# Altium project Python_Imaging.PrjPcb
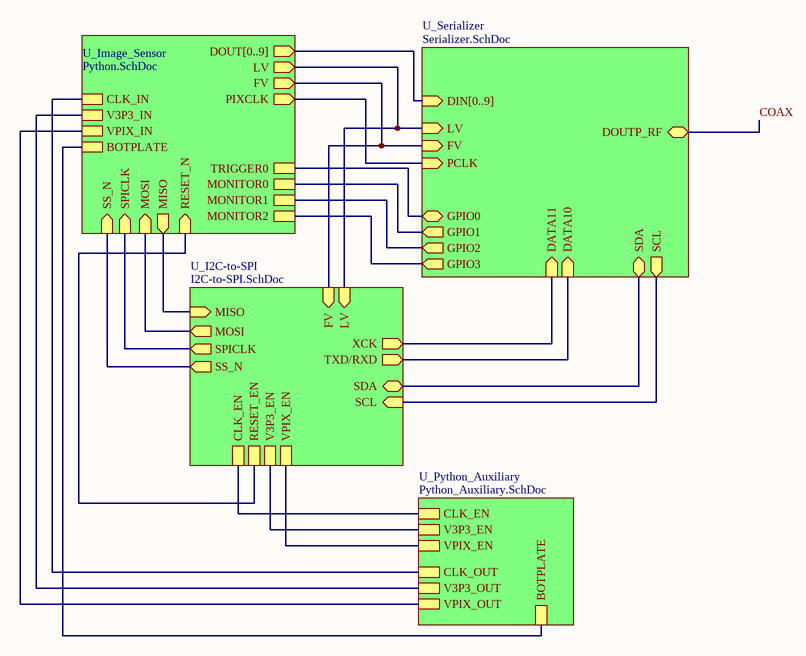
[diagram p0: Overall.SchDoc]
5 sheets, 59 parts. Net scope: hierarchical (ports join the sheet entries above them; power ports are global).
Board file: PCB2.PcbDoc
Sheets:
  Overall.SchDoc
    U_Image_Sensor = Python.SchDoc
    U_Serializer = Serializer.SchDoc
    U_I2C-to-SPI = I2C-to-SPI.SchDoc
    U_Python_Auxiliary = Python_Auxiliary.SchDoc

## Sheet Overall.SchDoc
size A

### Sub-sheets
U_I2C-to-SPI = I2C-to-SPI.SchDoc: SCL (in), SDA (bidir), MOSI (out), MISO (in), SPICLK (out), SS_N (out), TXD/RXD (out), XCK (out), FV (in), LV (in), CLK_EN, RESET_EN, V3P3_EN, VPIX_EN
U_Image_Sensor = Python.SchDoc: FV (out), LV (out), PIXCLK (out), DOUT[0..9] (out), SS_N (in), MISO (out), MOSI (in), SPICLK (in), RESET_N (in), CLK_IN, V3P3_IN, VPIX_IN, BOTPLATE, TRIGGER0, MONITOR0, MONITOR1, MONITOR2
U_Python_Auxiliary = Python_Auxiliary.SchDoc: CLK_EN, V3P3_EN, VPIX_EN, CLK_OUT, V3P3_OUT, VPIX_OUT, BOTPLATE
U_Serializer = Serializer.SchDoc: GPIO3 (out), GPIO2 (out), GPIO1 (out), GPIO0 (bidir), LV (in), FV (in), PCLK (in), SCL (out), SDA (bidir), DIN[0..9] (in), DOUTP_RF (bidir), DATA10 (in), DATA11 (in)

### Nets
BOTPLATE: sheet U_Image_Sensor/BOTPLATE, sheet U_Python_Auxiliary/BOTPLATE
CLK_EN: sheet U_I2C-to-SPI/CLK_EN, sheet U_Python_Auxiliary/CLK_EN
CLK_IN: sheet U_Image_Sensor/CLK_IN, sheet U_Python_Auxiliary/CLK_OUT
FV: sheet U_Image_Sensor/FV, sheet U_Serializer/FV, sheet U_I2C-to-SPI/FV
GPIO0: sheet U_Image_Sensor/TRIGGER0, sheet U_Serializer/GPIO0
GPIO1: sheet U_Image_Sensor/MONITOR0, sheet U_Serializer/GPIO1
GPIO2: sheet U_Image_Sensor/MONITOR1, sheet U_Serializer/GPIO2
GPIO3: sheet U_Image_Sensor/MONITOR2, sheet U_Serializer/GPIO3
LV: sheet U_Image_Sensor/LV, sheet U_Serializer/LV, sheet U_I2C-to-SPI/LV
MISO: sheet U_Image_Sensor/MISO, sheet U_I2C-to-SPI/MISO
MOSI: sheet U_Image_Sensor/MOSI, sheet U_I2C-to-SPI/MOSI
PCLK: sheet U_Image_Sensor/PIXCLK, sheet U_Serializer/PCLK
RESET_EN: sheet U_Image_Sensor/RESET_N, sheet U_I2C-to-SPI/RESET_EN
SCL: sheet U_Serializer/SCL, sheet U_I2C-to-SPI/SCL
SDA: sheet U_Serializer/SDA, sheet U_I2C-to-SPI/SDA
SPICLK: sheet U_Image_Sensor/SPICLK, sheet U_I2C-to-SPI/SPICLK
SS_N: sheet U_Image_Sensor/SS_N, sheet U_I2C-to-SPI/SS_N
TXD/RXD: sheet U_Serializer/DATA10, sheet U_I2C-to-SPI/TXD/RXD
V3P3_EN: sheet U_I2C-to-SPI/V3P3_EN, sheet U_Python_Auxiliary/V3P3_EN
V3P3_IN: sheet U_Image_Sensor/V3P3_IN, sheet U_Python_Auxiliary/V3P3_OUT
VPIX_EN: sheet U_I2C-to-SPI/VPIX_EN, sheet U_Python_Auxiliary/VPIX_EN
VPIX_IN: sheet U_Image_Sensor/VPIX_IN, sheet U_Python_Auxiliary/VPIX_OUT
XCK: sheet U_Serializer/DATA11, sheet U_I2C-to-SPI/XCK

### Buses and harness runs
bus sheet U_Image_Sensor/DOUT[0..9] = sheet U_Serializer/DIN[0..9]

## Sheet Python.SchDoc
size A
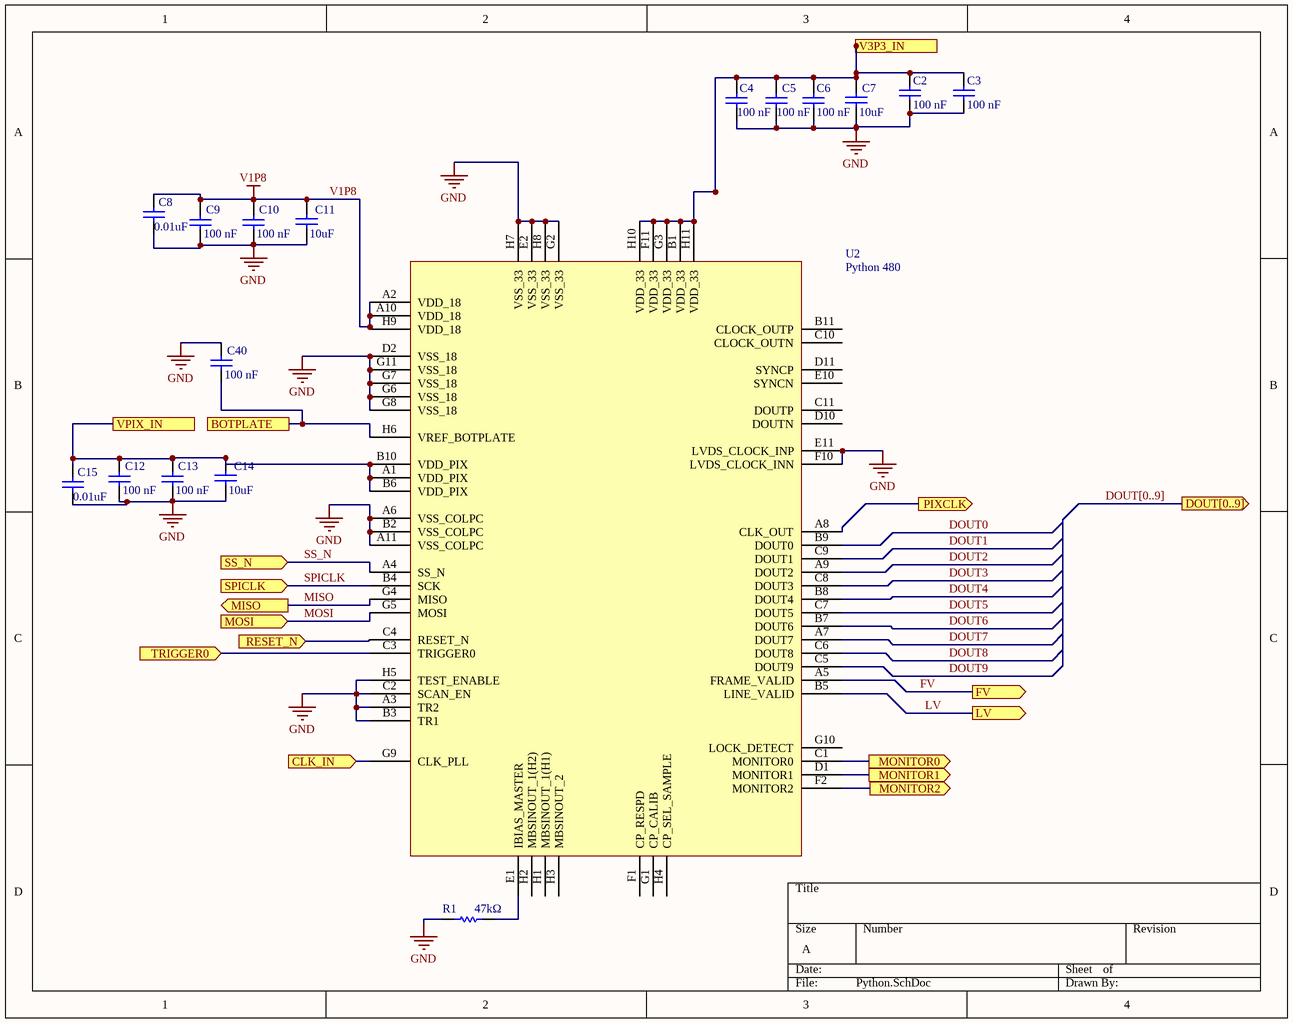
[diagram p1: Python.SchDoc]

### Parts
C2  Capacitance: 100 nF  [PCB-v6eq6etc9p7u7qdkgnno-1]  (hidden comment: GRM033C71C104KE14D)
C3  Capacitance: 100 nF  [PCB-v6eq6etc9p7u7qdkgnno-1]  (hidden comment: GRM033C71C104KE14D)
C4  Capacitance: 100 nF  [PCB-v6eq6etc9p7u7qdkgnno-1]  (hidden comment: GRM033C71C104KE14D)
C5  Capacitance: 100 nF  [PCB-v6eq6etc9p7u7qdkgnno-1]  (hidden comment: GRM033C71C104KE14D)
C6  Capacitance: 100 nF  [PCB-v6eq6etc9p7u7qdkgnno-1]  (hidden comment: GRM033C71C104KE14D)
C7  Capacitance: 10uF  [PCB-uspfzztrpe7hn2xlyjz9-1]  (hidden comment: GRM155R61A106ME11D)
C8  Capacitance: 0.01uF  [PCB-v6eq6etc9p7u7qdkgnno-1]  (hidden comment: GRM033R71A103KA01D)
C9  Capacitance: 100 nF  [PCB-v6eq6etc9p7u7qdkgnno-1]  (hidden comment: GRM033C71C104KE14D)
C10  Capacitance: 100 nF  [PCB-v6eq6etc9p7u7qdkgnno-1]  (hidden comment: GRM033C71C104KE14D)
C11  Capacitance: 10uF  [PCB-uspfzztrpe7hn2xlyjz9-1]  (hidden comment: GRM155R61A106ME11D)
C12  Capacitance: 100 nF  [PCB-v6eq6etc9p7u7qdkgnno-1]  (hidden comment: GRM033C71C104KE14D)
C13  Capacitance: 100 nF  [PCB-v6eq6etc9p7u7qdkgnno-1]  (hidden comment: GRM033C71C104KE14D)
C14  Capacitance: 10uF  [PCB-uspfzztrpe7hn2xlyjz9-1]  (hidden comment: GRM155R61A106ME11D)
C15  Capacitance: 0.01uF  [PCB-v6eq6etc9p7u7qdkgnno-1]  (hidden comment: GRM033R71A103KA01D)
C40  Capacitance: 100 nF  [PCB-v6eq6etc9p7u7qdkgnno-1]  (hidden comment: GRM033C71C104KE14D)
R1  Resistance: 47kΩ  [PCB-7g93mzch2qc2q3jid3ok-1]  (hidden comment: ERJ-1GNF4702C)
U2  Python 480  [Python 480]

### Ports
BOTPLATE, CLK_IN (in), DOUT[0..9] (out), FV (out), LV (out), MISO (out), MONITOR0 (out), MONITOR1 (out), MONITOR2 (out), MOSI (in), PIXCLK (out), RESET_N (in), SPICLK (in), SS_N (in), TRIGGER0 (in), V3P3_IN, VPIX_IN

### Nets
GND: C2.1 C3.1 C4.1 C5.1 C6.1 C7.2 C8.1 C9.1 C10.1 C11.2 C12.1 C13.1 C14.2 C15.1 C40.2 R1.1 U2.A3(TR2) U2.A6(VSS_COLPC) U2.A11(VSS_COLPC) U2.B2(VSS_COLPC) U2.B3(TR1) U2.C2(SCAN_EN) U2.D2(VSS_18) U2.E2(VSS_33) U2.E11(LVDS_CLOCK_INP) U2.F10(LVDS_CLOCK_INN) U2.G2(VSS_33) U2.G6(VSS_18) U2.G7(VSS_18) U2.G8(VSS_18) U2.G11(VSS_18) U2.H5(TEST_ENABLE) U2.H7(VSS_33) U2.H8(VSS_33)
V1P8: C8.2 C9.2 C10.2 C11.1 U2.A2(VDD_18) U2.A10(VDD_18) U2.H9(VDD_18)
BOTPLATE: C40.1 U2.H6(VREF_BOTPLATE) ; port BOTPLATE
CLK_IN: U2.G9(CLK_PLL) ; port CLK_IN
DOUT0: U2.B9(DOUT0)  [project net DATA0]
DOUT1: U2.C9(DOUT1)  [project net DATA1]
DOUT2: U2.A9(DOUT2)  [project net DATA2]
DOUT3: U2.C8(DOUT3)  [project net DATA3]
DOUT4: U2.B8(DOUT4)  [project net DATA4]
DOUT5: U2.C7(DOUT5)  [project net DATA5]
DOUT6: U2.B7(DOUT6)  [project net DATA6]
DOUT7: U2.A7(DOUT7)  [project net DATA7]
DOUT8: U2.C6(DOUT8)  [project net DATA8]
DOUT9: U2.C5(DOUT9)  [project net DATA9]
FV: U2.A5(FRAME_VALID) ; port FV
GPIO0: U2.C3(TRIGGER0) ; port TRIGGER0
GPIO1: U2.C1(MONITOR0) ; port MONITOR0
GPIO2: U2.D1(MONITOR1) ; port MONITOR1
GPIO3: U2.F2(MONITOR2) ; port MONITOR2
LV: U2.B5(LINE_VALID) ; port LV
MISO: U2.G4(MISO) ; port MISO
MOSI: U2.G5(MOSI) ; port MOSI
PCLK: U2.A8(CLK_OUT) ; port PIXCLK
RESET_EN: U2.C4(RESET_N) ; port RESET_N
SPICLK: U2.B4(SCK) ; port SPICLK
SS_N: U2.A4(SS_N) ; port SS_N
V3P3_IN: C2.2 C3.2 C4.2 C5.2 C6.2 C7.1 U2.B1(VDD_33) U2.F11(VDD_33) U2.G3(VDD_33) U2.H10(VDD_33) U2.H11(VDD_33) ; port V3P3_IN
VPIX_IN: C12.2 C13.2 C14.1 C15.2 U2.A1(VDD_PIX) U2.B6(VDD_PIX) U2.B10(VDD_PIX) ; port VPIX_IN
NetR1_2: R1.2 U2.E1(IBIAS_MASTER)

Not connected (* = marked no-connect by the designer): U2 B11(CLOCK_OUTP) C10(CLOCK_OUTN) C11(DOUTP) D10(DOUTN) D11(SYNCP) E10(SYNCN) F1(CP_RESPD) G1(CP_CALIB) G10(LOCK_DETECT) H1(MBSINOUT_1(H1)) H2(MBSINOUT_1(H2)) H3(MBSINOUT_2) H4(CP_SEL_SAMPLE)

### Buses and harness runs
bus DOUT[0..9] = port DOUT[0..9]

### Library data of the parts
C2-C6 C9 C10 C12 C13 C40 = CMP-cc290632c88a13ee-3: 0.1 µF ±10% 16V Ceramic Capacitor X7S 0201 (0603 Metric); Lead-Free Status: Lead Free; Voltage Rating (DC): 16.0 V; Packaging: Reel; Dielectric Characteristic: X7S; OctopartID: cc290632c88a13ee; Size-Width: 300 µm; Manufacturer Part Number: GRM033C71C104KE14D; Case/Package: 0201; Capacitance Tolerance: ±10%; Size-Length: 600 µm; Octopart URL: http://octopart.com/grm033c71c104ke14d-murata-51454405; Mounting Style: Surface Mount; Size-Thickness: 300 µm; RoHS: Compliant
C7 C11 C14 = CMP-eacb22ede71a350c-8: 10 µF ±20% 10V Ceramic Capacitor X5R 0402 (1005 Metric)
C8 C15 = CMP-19299660-4: 10000 pF ±10% 10V Ceramic Capacitor X7R 0201 (0603 Metric); Case/Package: 0201
R1 = CMP-1848656-4: 47 kOhms ±1% 0.05W, 1/20W Chip Resistor 0201 (0603 Metric) Automotive AEC-Q200 Thick Film; Lead-Free Status: Lead Free; Voltage Rating (DC): 15.0 V; Case/Package: 0201; Lifecycle Status: Not Listed by Manufacturer; Mounting Style: Surface Mount; Octopart Url: https://octopart.com/erj-1gef1822c-panasonic-39782564; OctopartID: 543c9f6979fe8bfb; Power Rating: 0.05 W; Resistance Tolerance: ±1%; RoHS: Compliant; Size-Height: 0.00023 m; Size-Width: 0.0003 m
U2 = CMP-zuljd18wlr9in3443qu3-3: image sensor from ONSemi

## Sheet Serializer.SchDoc
size A
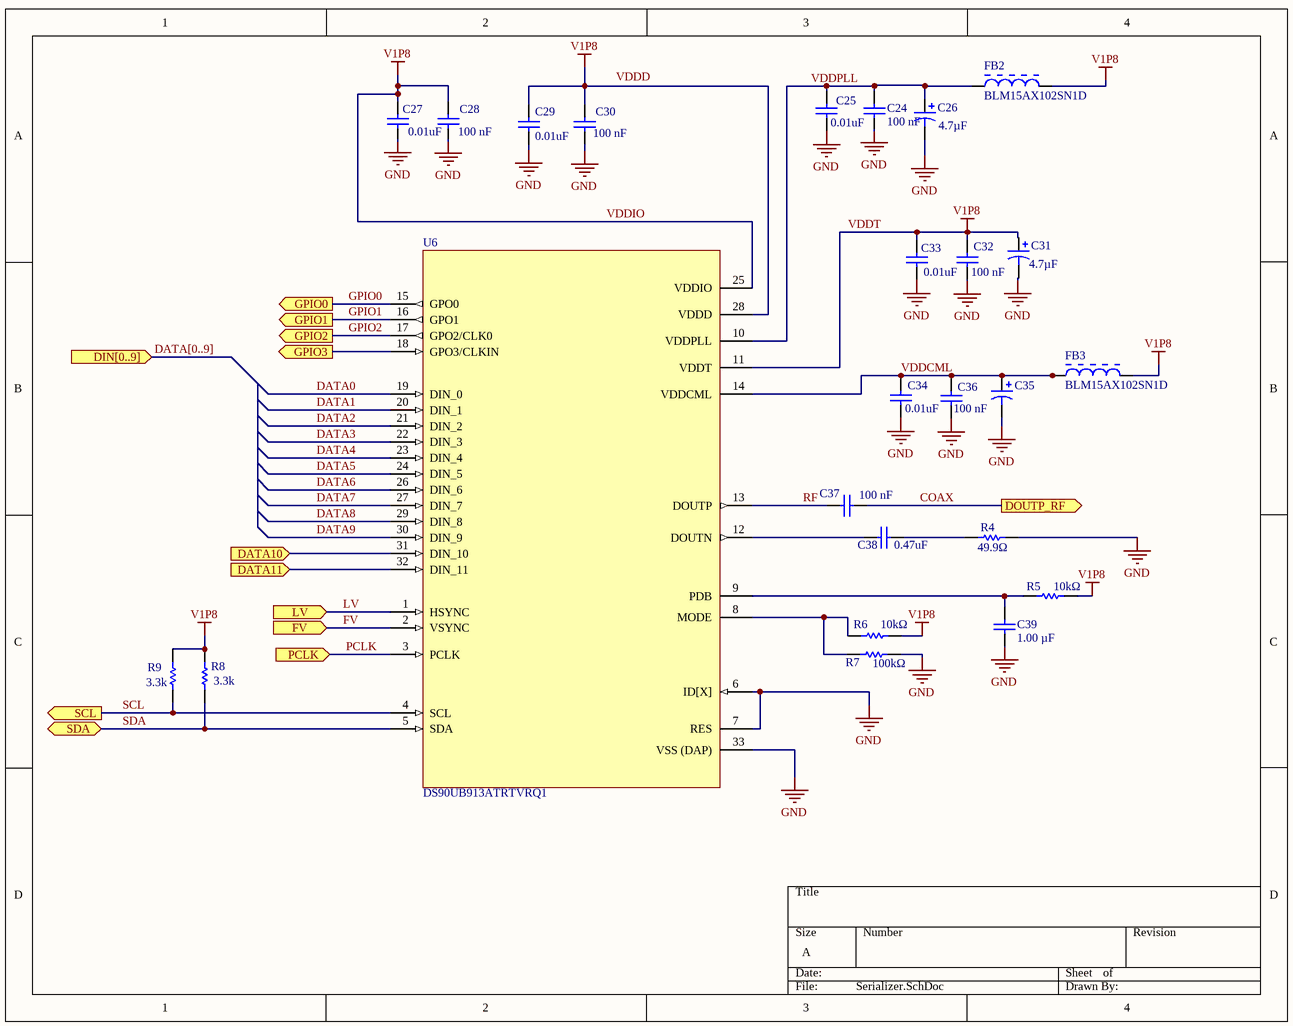
[diagram p2: Serializer.SchDoc]

### Parts
C24  Capacitance: 100 nF  [PCB-v6eq6etc9p7u7qdkgnno-1]  (hidden comment: GRM033C71C104KE14D)
C25  Capacitance: 0.01uF  [PCB-v6eq6etc9p7u7qdkgnno-1]  (hidden comment: GRM033R71A103KA01D)
C26  Capacitance: 4.7µF  [PCB-t0dwbiosd2m6unyihqym-1]  (hidden comment: F981A475MUALZT)
C27  Capacitance: 0.01uF  [PCB-v6eq6etc9p7u7qdkgnno-1]  (hidden comment: GRM033R71A103KA01D)
C28  Capacitance: 100 nF  [PCB-v6eq6etc9p7u7qdkgnno-1]  (hidden comment: GRM033C71C104KE14D)
C29  Capacitance: 0.01uF  [PCB-v6eq6etc9p7u7qdkgnno-1]  (hidden comment: GRM033R71A103KA01D)
C30  Capacitance: 100 nF  [PCB-v6eq6etc9p7u7qdkgnno-1]  (hidden comment: GRM033C71C104KE14D)
C31  Capacitance: 4.7µF  [PCB-t0dwbiosd2m6unyihqym-1]  (hidden comment: F981A475MUALZT)
C32  Capacitance: 100 nF  [PCB-v6eq6etc9p7u7qdkgnno-1]  (hidden comment: GRM033C71C104KE14D)
C33  Capacitance: 0.01uF  [PCB-v6eq6etc9p7u7qdkgnno-1]  (hidden comment: GRM033R71A103KA01D)
C34  Capacitance: 0.01uF  [PCB-v6eq6etc9p7u7qdkgnno-1]  (hidden comment: GRM033R71A103KA01D)
C35  F981A226MMALZT  [PCB-yxd74t6run51sg1ha7ug-1]  (value not drawn)
C36  Capacitance: 100 nF  [PCB-v6eq6etc9p7u7qdkgnno-1]  (hidden comment: GRM033C71C104KE14D)
C37  Capacitance: 100 nF  [PCB-v6eq6etc9p7u7qdkgnno-1]  (hidden comment: GRM033C71C104KE14D)
C38  Capacitance: 0.47uF  [PCB-v6eq6etc9p7u7qdkgnno-1]  (hidden comment: GRM033R60J473KE19D)
C39  Capacitance: 1.00 µF  [PCB-v6eq6etc9p7u7qdkgnno-1]  (hidden comment: GRM033R60J105MEA2D)
FB2  BLM15AX102SN1D  [MURA-BLM15-CHIP-2_V]
FB3  BLM15AX102SN1D  [MURA-BLM15-CHIP-2_V]
R4  Resistance: 49.9Ω  [PCB-7g93mzch2qc2q3jid3ok-1]  (hidden comment: TNPW020149R9BEED)
R5  Resistance: 10kΩ  [PCB-7g93mzch2qc2q3jid3ok-1]  (hidden comment: ERJ-1GNF1002C)
R6  Resistance: 10kΩ  [PCB-7g93mzch2qc2q3jid3ok-1]  (hidden comment: ERJ-1GNF1002C)
R7  Resistance: 100kΩ  [PCB-7g93mzch2qc2q3jid3ok-1]  (hidden comment: ERJ-1GNF1003C)
R8  Resistance: 3.3k  [PCB-7g93mzch2qc2q3jid3ok-1]  (hidden comment: ERJ-1GNF3301C)
R9  Resistance: 3.3k  [PCB-7g93mzch2qc2q3jid3ok-1]  (hidden comment: ERJ-1GNF3301C)
U6  DS90UB913ATRTVRQ1  [PCB-l2nnig1h4ckv44w98gav-1]

### Ports
DATA10 (in), DATA11 (in), DIN[0..9] (in), DOUTP_RF (out), FV (in), GPIO0 (out), GPIO1 (out), GPIO2 (out), GPIO3 (out), LV (in), PCLK (in), SCL (out), SDA (bidir)

### Nets
GND: C24.1 C25.1 C26.2 C27.1 C28.1 C29.1 C30.1 C31.2 C32.1 C33.1 C34.1 C35.2 C36.1 C39.1 R4.2 R7.2 U6.6(ID[X]) U6.7(RES) U6.33(VSS_(DAP))
V1P8: C27.2 C28.2 C29.2 C30.2 C31.1 C32.2 C33.2 FB2.2 FB3.2 R5.2 R6.2 R8.2 R9.2 U6.11(VDDT) U6.25(VDDIO) U6.28(VDDD)  [also labelled VDDIO, VDDT]
COAX: C37.1 ; port DOUTP_RF
DATA0: U6.19(DIN_0)
DATA1: U6.20(DIN_1)
DATA2: U6.21(DIN_2)
DATA3: U6.22(DIN_3)
DATA4: U6.23(DIN_4)
DATA5: U6.24(DIN_5)
DATA6: U6.26(DIN_6)
DATA7: U6.27(DIN_7)
DATA8: U6.29(DIN_8)
DATA9: U6.30(DIN_9)
FV: U6.2(VSYNC) ; port FV
GPIO0: U6.15(GPO0) ; port GPIO0
GPIO1: U6.16(GPO1) ; port GPIO1
GPIO2: U6.17(GPO2/CLK0) ; port GPIO2
GPIO3: U6.18(GPO3/CLKIN) ; port GPIO3
LV: U6.1(HSYNC) ; port LV
PCLK: U6.3(PCLK) ; port PCLK
RF: C37.2 U6.13(DOUTP)
SCL: R9.1 U6.4(SCL) ; port SCL
SDA: R8.1 U6.5(SDA) ; port SDA
TXD/RXD: U6.31(DIN_10) ; port DATA10
VDDCML: C34.2 C35.1 C36.2 FB3.1 U6.14(VDDCML)
VDDPLL: C24.2 C25.2 C26.1 FB2.1 U6.10(VDDPLL)
XCK: U6.32(DIN_11) ; port DATA11
NetC38_1: C38.1 U6.12(DOUTN)
NetC38_2: C38.2 R4.1
NetC39_2: C39.2 R5.1 U6.9(PDB)
NetR6_1: R6.1 R7.1 U6.8(MODE)

### Buses and harness runs
bus DATA[0..9] = port DIN[0..9]

### Notes on the sheet
- Labels drawn without touching a wire or pin: VDDD

### Library data of the parts
C24 C28 C30 C32 C36 C37 = CMP-cc290632c88a13ee-3: as C2 on sheet Python; Packaging: Reel; Dielectric Characteristic: X7S; OctopartID: cc290632c88a13ee; Size-Width: 300 µm; Manufacturer Part Number: GRM033C71C104KE14D; Case/Package: 0201; Capacitance Tolerance: ±10%; Size-Length: 600 µm; Octopart URL: http://octopart.com/grm033c71c104ke14d-murata-51454405; Mounting Style: Surface Mount; Size-Thickness: 300 µm; RoHS: Compliant
C25 C27 C29 C33 C34 = CMP-19299660-4: as C8 on sheet Python; Case/Package: 0201
C26 C31 = CMP-b7737c8c1b6d68b4-6: 4.7 µF Molded Tantalum Capacitors 10 V 0402 (1005 Metric) -; Voltage - Rated: 10V; OctopartID: b7737c8c1b6d68b4; Octopart URL: http://octopart.com/f981a475mualzt-avx-49645944; Packaging: Tape & Reel (TR)
C35 = CMP-ed552659f9643292-2: 22 µF Molded Tantalum Capacitors 10 V 0603 (1608 Metric) 8Ohm @ 100kHz; Capacitance: 22µF; Voltage Rating: 10Vdc; Octopart URL: http://octopart.com/f981a226mmalzt-avx-33960279; Manufacturer Part Number: F981A226MMALZT; Packaging: Reel; Case/Package: 0603
C38 = CMP-131779-4: 0.047 µF ±10% 6.3V Ceramic Capacitor X5R 0201 (0603 Metric); Case/Package (SI): 0603; Capacitance Tolerance: ±10%; Dielectric Characteristic: X5R; RoHS: Compliant; Size-Length: 0.0006 m; Size-Width: 0.0003 m; Voltage Rating (DC): 6.3 V
C39 = CMP-7dcab586fd61a20d-5: 1 µF ±20% 6.3V Ceramic Capacitor X5R 0201 (0603 Metric); Case/Package (SI): 0603; Dielectric Characteristic: X5R; Size-Length: 600 µm; OctopartID: 7dcab586fd61a20d
FB2 FB3 = CMP-886590-4: 1 kOhms @ 100 MHz 1 - Ferrite Bead 0402 (1005 Metric) 350mA 490mOhm; Lead-Free Status: Lead Free; Number of Circuits: 1; Resistance: 1000.0 Ω; Octopart Url: https://octopart.com/blm15ax102sn1d-murata-17749155; OctopartID: 6cdea4da9d1bb319; REACH SVHC Compliance: No SVHC; RoHS: Compliant; Size-Length: 0.001 m; Size-Width: 0.0005 m
R4 = CMP-1848375-4: 49.9 Ohms ±0.1% 0.05W, 1/20W Chip Resistor 0201 (0603 Metric) Anti-Sulfur, Automotive AEC-Q200, Moisture Resistant Thin Film; Packaging: Cut Tape (CT); Power Rating: 0.05 W
R5 R6 = CMP-1848298-4: 10 kOhms ±1% 0.05W, 1/20W Chip Resistor 0201 (0603 Metric) Automotive AEC-Q200 Thick Film; Lead-Free Status: Lead Free; Resistance Tolerance: ±5%; Voltage Rating (DC): 25.0 V; Case/Package: 0201; Lifecycle Status: Not Listed by Manufacturer; Mounting Style: Surface Mount; Octopart Url: https://octopart.com/erj-1gej103c-panasonic-39841918; Power Rating: 0.05 W; RoHS: Compliant; Size-Height: 0.00023 m; Size-Length: 0.0006 m; Size-Width: 0.0003 m
R7 = CMP-1848300-4: 100 kOhms ±1% 0.05W, 1/20W Chip Resistor 0201 (0603 Metric) Automotive AEC-Q200 Thick Film; Lifecycle Status: Not Listed by Manufacturer; Octopart Url: https://octopart.com/erj-1gej104c-panasonic-55411467; Size-Height: 0.00023 m; Size-Width: 0.0003 m
R8 R9 = CMP-1848326-4: 3.3 kOhms ±1% 0.05W, 1/20W Chip Resistor 0201 (0603 Metric) Automotive AEC-Q200 Thick Film; Resistance Tolerance: ±5%; Size-Height: 0.00023 m
U6 = CMP-1f96d75fdae3c051-6: 1.4Gbps Serializer 12 Input 1 Output 32-WQFN (5x5); Octopart URL: http://octopart.com/ds90ub913atrtvrq1-texas+instruments-29614099; Packaging: Reel; RoHS: Compliant; Case/Package: WQFN; Number of Pins: 32

## Sheet I2C-to-SPI.SchDoc
size A
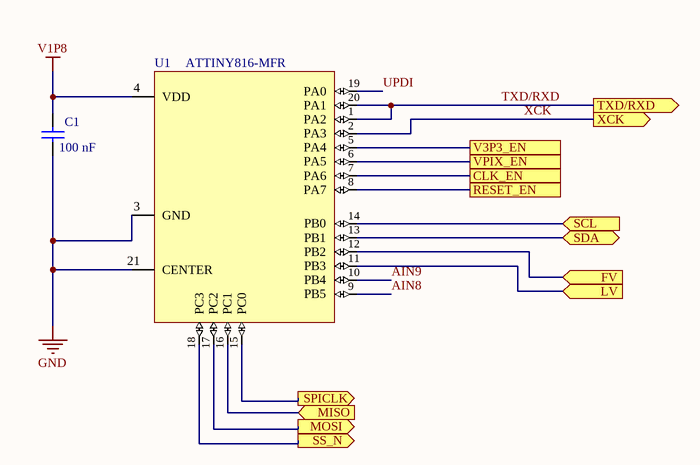
[diagram p3: I2C-to-SPI.SchDoc]

### Parts
C1  Capacitance: 100 nF  [PCB-v6eq6etc9p7u7qdkgnno-1]  (hidden comment: GRM033C71C104KE14D)
U1  ATTINY816-MFR  [PCB-hv4cq49t2e9uf1npj5by-1]

### Ports
CLK_EN, FV (in), LV (in), MISO (in), MOSI (out), RESET_EN, SCL (in), SDA (bidir), SPICLK (out), SS_N (out), TXD/RXD (out), V3P3_EN, VPIX_EN, XCK (out)

### Nets
GND: C1.1 U1.3(GND) U1.21(CENTER)
V1P8: C1.2 U1.4(VDD)
AIN8: U1.9(PB5)
AIN9: U1.10(PB4)
CLK_EN: U1.7(PA6) ; port CLK_EN
FV: U1.12(PB2) ; port FV
LV: U1.11(PB3) ; port LV
MISO: U1.16(PC1) ; port MISO
MOSI: U1.17(PC2) ; port MOSI
RESET_EN: U1.8(PA7) ; port RESET_EN
SCL: U1.14(PB0) ; port SCL
SDA: U1.13(PB1) ; port SDA
SPICLK: U1.15(PC0) ; port SPICLK
SS_N: U1.18(PC3) ; port SS_N
TXD/RXD: U1.1(PA2) U1.20(PA1) ; port TXD/RXD
UPDI: U1.19(PA0)
V3P3_EN: U1.5(PA4) ; port V3P3_EN
VPIX_EN: U1.6(PA5) ; port VPIX_EN
XCK: U1.2(PA3) ; port XCK

### Library data of the parts
C1 = CMP-cc290632c88a13ee-3: 0.1 µF ±10% 16V Ceramic Capacitor X7S 0201 (0603 Metric) /; Voltage Rating (DC): 16.0 V; Lead-Free Status: Lead Free; Size-Length: 600 µm; Capacitance Tolerance: ±10%; Size-Thickness: 300 µm; Packaging: Reel; OctopartID: cc290632c88a13ee; RoHS: Compliant; Case/Package: 0201; Size-Width: 300 µm; Manufacturer Part Number: GRM033C71C104KE14D; Dielectric Characteristic: X7S; Octopart URL: http://octopart.com/grm033c71c104ke14d-murata-51454405; Mounting Style: Surface Mount
U1 = CMP-1cb5d12d1e47c372-8: AVR series Microcontroller IC 8-Bit 16MHz 8KB (8K x 8) FLASH 20-VQFN (3x3); RAM Memory Size: 512 B; Clock Speed: 20.0 MHz; RoHS: Compliant; Manufacturer Part Number: ATTINY816-MFR; Octopart URL: http://octopart.com/attiny816-mfr-microchip-76687252

## Sheet Python_Auxiliary.SchDoc
size A
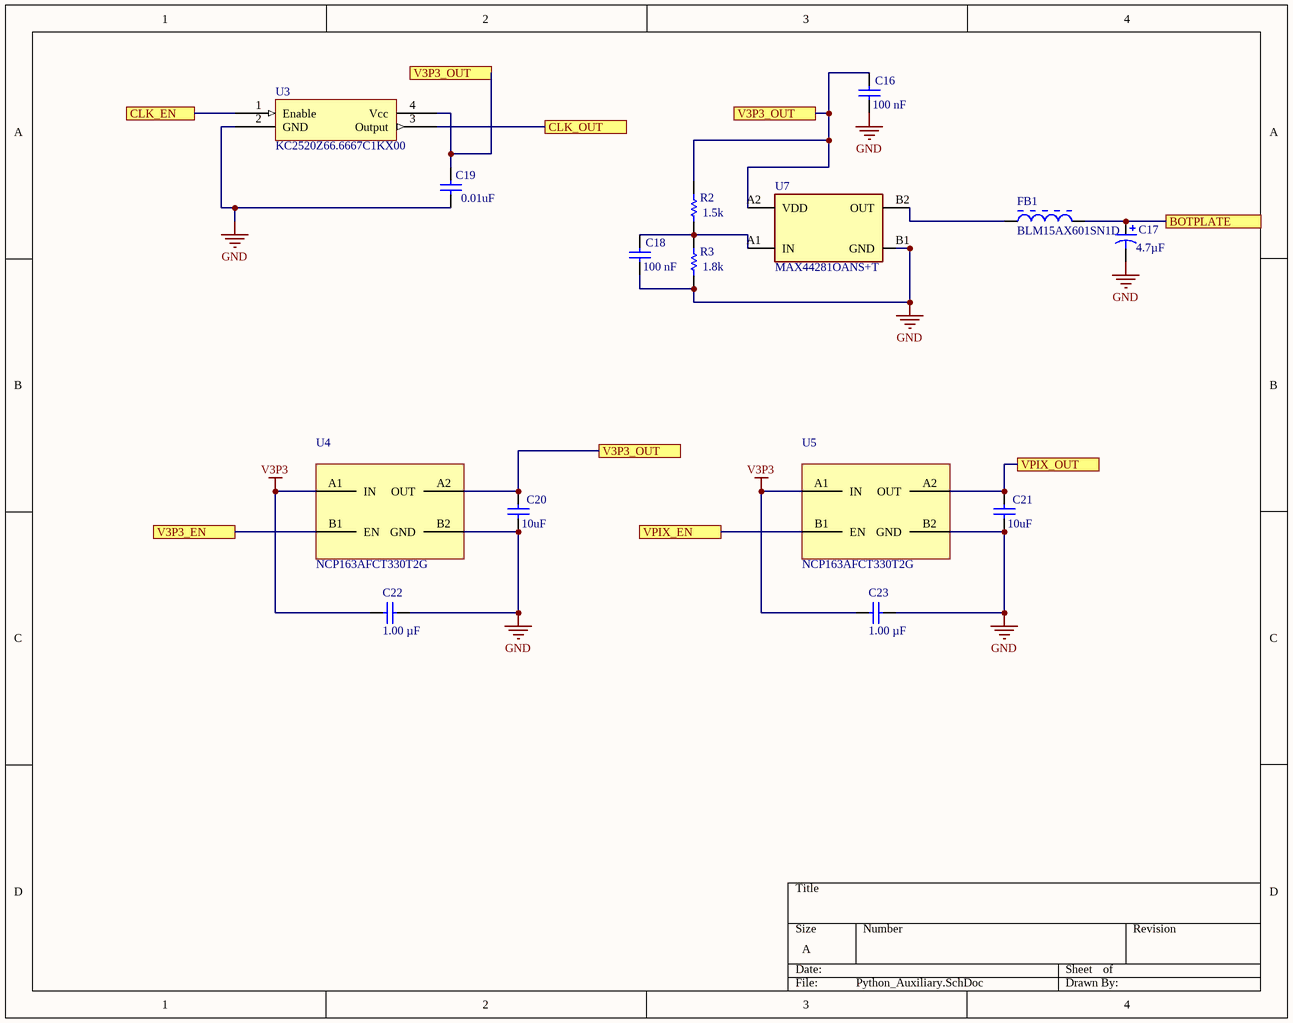
[diagram p4: Python_Auxiliary.SchDoc]

### Parts
C16  Capacitance: 100 nF  [PCB-v6eq6etc9p7u7qdkgnno-1]  (hidden comment: GRM033C71C104KE14D)
C17  Capacitance: 4.7µF  [PCB-t0dwbiosd2m6unyihqym-1]  (hidden comment: F981A475MUALZT)
C18  Capacitance: 100 nF  [PCB-v6eq6etc9p7u7qdkgnno-1]  (hidden comment: GRM033C71C104KE14D)
C19  Capacitance: 0.01uF  [PCB-v6eq6etc9p7u7qdkgnno-1]  (hidden comment: GRM033R71A103KA01D)
C20  Capacitance: 10uF  [PCB-uspfzztrpe7hn2xlyjz9-1]  (hidden comment: GRM155R61A106ME11D)
C21  Capacitance: 10uF  [PCB-uspfzztrpe7hn2xlyjz9-1]  (hidden comment: GRM155R61A106ME11D)
C22  Capacitance: 1.00 µF  [PCB-v6eq6etc9p7u7qdkgnno-1]  (hidden comment: GRM033R60J105MEA2D)
C23  Capacitance: 1.00 µF  [PCB-v6eq6etc9p7u7qdkgnno-1]  (hidden comment: GRM033R60J105MEA2D)
FB1  BLM15AX601SN1D  [MURA-BLM15-CHIP-2_V]
R2  Resistance: 1.5k  [PCB-7g93mzch2qc2q3jid3ok-1]  (hidden comment: ERA-1AEB152C)
R3  Resistance: 1.8k  [PCB-7g93mzch2qc2q3jid3ok-1]  (hidden comment: CRCW02011K80JNED)
U3  KC2520Z66.6667C1KX00  [ASD]
U4  NCP163AFCT330T2G  [PCB-ng8273kv6qqz2xsov2q1-1]
U5  NCP163AFCT330T2G  [PCB-ng8273kv6qqz2xsov2q1-1]
U7  MAX44281OANS+T  [FP-N40A0-1-MFG]

### Ports
BOTPLATE, CLK_EN, CLK_OUT, V3P3_EN, V3P3_OUT, VPIX_EN, VPIX_OUT

### Nets
GND: C16.1 C17.2 C18.1 C19.1 C20.2 C21.2 C22.1 C23.1 R3.1 U3.2(GND) U4.B2(GND) U5.B2(GND) U7.B1(GND)
V3P3: C22.2 C23.2 U4.A1(IN) U5.A1(IN)
BOTPLATE: C17.1 FB1.2 ; port BOTPLATE
CLK_EN: U3.1(Enable) ; port CLK_EN
CLK_IN: U3.3(Output) ; port CLK_OUT
V3P3_EN: U4.B1(EN) ; port V3P3_EN
V3P3_IN: C16.2 C19.2 C20.1 R2.2 U3.4(Vcc) U4.A2(OUT) U7.A2(VDD) ; port V3P3_OUT
VPIX_EN: U5.B1(EN) ; port VPIX_EN
VPIX_IN: C21.1 U5.A2(OUT) ; port VPIX_OUT
NetC18_2: C18.2 R2.1 R3.2 U7.A1(IN)
NetFB1_1: FB1.1 U7.B2(OUT)

### Library data of the parts
C16 C18 = CMP-cc290632c88a13ee-3: as C2 on sheet Python; Packaging: Reel; Dielectric Characteristic: X7S; OctopartID: cc290632c88a13ee; Size-Width: 300 µm; Manufacturer Part Number: GRM033C71C104KE14D; Case/Package: 0201; Capacitance Tolerance: ±10%; Size-Length: 600 µm; Octopart URL: http://octopart.com/grm033c71c104ke14d-murata-51454405; Mounting Style: Surface Mount; Size-Thickness: 300 µm; RoHS: Compliant
C17 = CMP-b7737c8c1b6d68b4-6: as C26 on sheet Serializer; OctopartID: b7737c8c1b6d68b4; Octopart URL: http://octopart.com/f981a475mualzt-avx-49645944; Packaging: Tape & Reel (TR)
C19 = CMP-19299660-4: as C8 on sheet Python; Case/Package: 0201
C20 C21 = CMP-eacb22ede71a350c-8: as C7 on sheet Python
C22 C23 = CMP-7dcab586fd61a20d-5: as C39 on sheet Serializer; Dielectric Characteristic: X5R; Size-Length: 600 µm; OctopartID: 7dcab586fd61a20d
FB1 = CMP-886590-4: 600 Ohms @ 100 MHz 1 - Ferrite Bead 0402 (1005 Metric) 500mA 340mOhm; Lead-Free Status: Lead Free; Number of Circuits: 1; Resistance: 1000.0 Ω; Octopart Url: https://octopart.com/blm15ax102sn1d-murata-17749155; OctopartID: 6cdea4da9d1bb319; REACH SVHC Compliance: No SVHC; RoHS: Compliant; Size-Length: 0.001 m; Size-Width: 0.0005 m
R2 = CMP-1848326-4: 1.5 kOhms ±0.1% 0.05W, 1/20W Chip Resistor 0201 (0603 Metric) - Thin Film; Resistance Tolerance: ±5%; Size-Height: 0.00023 m
R3 = CMP-1848326-4: 1.8 kOhms ±5% 0.05W, 1/20W Chip Resistor 0201 (0603 Metric) - Thick Film; Resistance Tolerance: ±5%; Size-Height: 0.00023 m
U3 = ASD oscillator: 66.667 MHz XO (Standard) CMOS Oscillator 1.71V ~ 3.63V Standby (Power Down) 4-SMD, No Lead
U4 U5 = CMP-c6890ab21004194e-8: Linear Voltage Regulator IC Positive Fixed 1 Output 250mA 4-WLCSP (0.64x0.64)
U7 = CMP-05699-000060-1: General Purpose Amplifier 1 Circuit Rail-to-Rail 4-WLP (0.84x0.84); RoHS Compliant: Yes

## Nets that join several sheets
GND: Python (34 pins), Serializer (19 pins), I2C-to-SPI (C1.1 U1.3 U1.21), Python_Auxiliary (13 pins)
V1P8: Python (7 pins), Serializer (16 pins), I2C-to-SPI (C1.2 U1.4)
BOTPLATE: Python (C40.1 U2.H6), Python_Auxiliary (C17.1 FB1.2)
CLK_EN: I2C-to-SPI (U1.7), Python_Auxiliary (U3.1)
CLK_IN: Python (U2.G9), Python_Auxiliary (U3.3)
DATA0: Python (U2.B9), Serializer (U6.19)
DATA1: Python (U2.C9), Serializer (U6.20)
DATA2: Python (U2.A9), Serializer (U6.21)
DATA3: Python (U2.C8), Serializer (U6.22)
DATA4: Python (U2.B8), Serializer (U6.23)
DATA5: Python (U2.C7), Serializer (U6.24)
DATA6: Python (U2.B7), Serializer (U6.26)
DATA7: Python (U2.A7), Serializer (U6.27)
DATA8: Python (U2.C6), Serializer (U6.29)
DATA9: Python (U2.C5), Serializer (U6.30)
FV: Python (U2.A5), Serializer (U6.2), I2C-to-SPI (U1.12)
GPIO0: Python (U2.C3), Serializer (U6.15)
GPIO1: Python (U2.C1), Serializer (U6.16)
GPIO2: Python (U2.D1), Serializer (U6.17)
GPIO3: Python (U2.F2), Serializer (U6.18)
LV: Python (U2.B5), Serializer (U6.1), I2C-to-SPI (U1.11)
MISO: Python (U2.G4), I2C-to-SPI (U1.16)
MOSI: Python (U2.G5), I2C-to-SPI (U1.17)
PCLK: Python (U2.A8), Serializer (U6.3)
RESET_EN: Python (U2.C4), I2C-to-SPI (U1.8)
SCL: Serializer (R9.1 U6.4), I2C-to-SPI (U1.14)
SDA: Serializer (R8.1 U6.5), I2C-to-SPI (U1.13)
SPICLK: Python (U2.B4), I2C-to-SPI (U1.15)
SS_N: Python (U2.A4), I2C-to-SPI (U1.18)
TXD/RXD: Serializer (U6.31), I2C-to-SPI (U1.1 U1.20)
V3P3_EN: I2C-to-SPI (U1.5), Python_Auxiliary (U4.B1)
V3P3_IN: Python (11 pins), Python_Auxiliary (7 pins)
VPIX_EN: I2C-to-SPI (U1.6), Python_Auxiliary (U5.B1)
VPIX_IN: Python (7 pins), Python_Auxiliary (C21.1 U5.A2)
XCK: Serializer (U6.32), I2C-to-SPI (U1.2)